# Altium schematic sheet connectors.SchDoc: Power and Connectors
size A3; Author: Pietro Lorefice; Organization: DB Home System
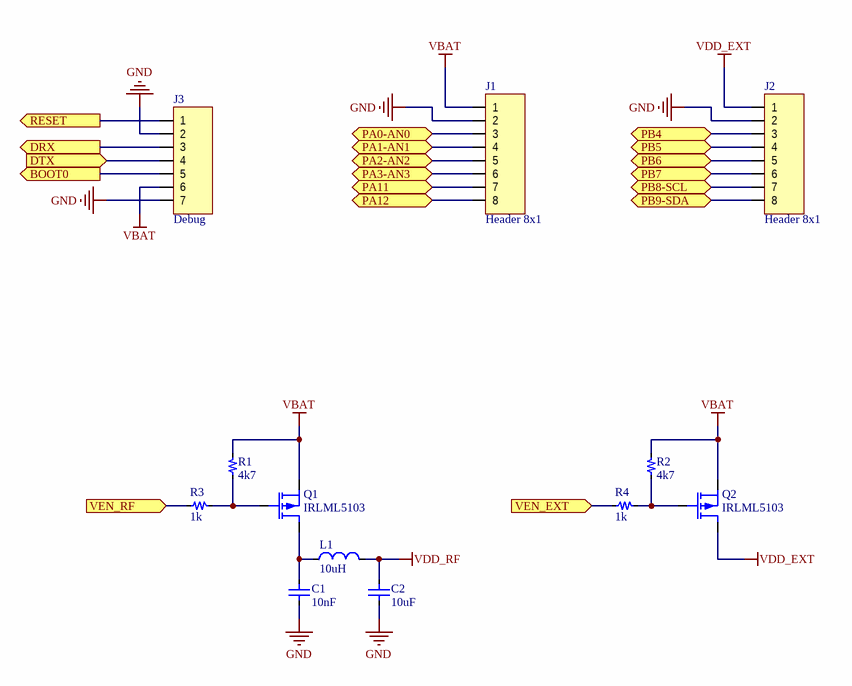
[diagram p0: connectors.SchDoc]

## Parts
C1  10nF  [0402_[1005]]
C2  10uF  [0603_[1608]]
J1  Header 8x1  [HDR8x1-H]
J2  Header 8x1  [HDR8x1-H]
J3  Debug  [HDR7x1-H]
L1  10uH  [1206_[3216]]
Q1  IRLML5103  [SOT-23-MOS]
Q2  IRLML5103  [SOT-23-MOS]
R1  4k7  [0402_[1005]]
R2  4k7  [0402_[1005]]
R3  1k  [0402_[1005]]
R4  1k  [0402_[1005]]

## Ports
BOOT0 (out), DRX (out), DTX (in), PA0-AN0 (bidir), PA1-AN1 (bidir), PA2-AN2 (bidir), PA3-AN3 (bidir), PA11 (bidir), PA12 (bidir), PB4 (bidir), PB5 (bidir), PB6 (bidir), PB7 (bidir), PB8-SCL (bidir), PB9-SDA (bidir), RESET (out), VEN_EXT (in), VEN_RF (in)

## Nets
GND: C1.1 C2.1 J1.2 J2.2 J3.2 J3.7
VBAT: J1.1 J3.6 Q1.3(S) Q2.3(S) R1.2 R2.2
VDD_EXT: J2.1 Q2.2(D)
VDD_RF: C2.2 L1.2
BOOT0: J3.5 ; port BOOT0
DRX: J3.3 ; port DRX
DTX: J3.4 ; port DTX
PA0-AN0: J1.3 ; port PA0-AN0
PA1-AN1: J1.4 ; port PA1-AN1
PA2-AN2: J1.5 ; port PA2-AN2
PA3-AN3: J1.6 ; port PA3-AN3
PA11: J1.7 ; port PA11
PA12: J1.8 ; port PA12
PB4: J2.3 ; port PB4
PB5: J2.4 ; port PB5
PB6: J2.5 ; port PB6
PB7: J2.6 ; port PB7
PB8-SCL: J2.7 ; port PB8-SCL
PB9-SDA: J2.8 ; port PB9-SDA
RESET: J3.1 ; port RESET
VEN_EXT: R4.1 ; port VEN_EXT
VEN_RF: R3.1 ; port VEN_RF
NetC1_2: C1.2 L1.1 Q1.2(D)
NetQ1_1: Q1.1(G) R1.1 R3.2
NetQ2_1: Q2.1(G) R2.1 R4.2

## Notes on the sheet
- Project:
- Title:
- Author:
- Licensed:
- Rev:
- Size:
- A3
- File:
- Date:
- Sheet
- of

## Library data of the parts
C1 C2 = C: Capacitor
  C1: Value: 10nF
  C2: Value: 10uF
J1 J2 = HDR 8x1: Pin header, 8x1
J3 = HDR 7x1: Pin header, 7x1
L1 = L: Inductor; Value: 10uH
Q1 Q2 = PMOS: P-channel MOSFET; pin to pad: 2>3 3>2
R1-R4 = R: Resistor
  R1 R2: Value: 4k7
  R3 R4: Value: 1k